# Altium project PCB_PROJECT1.PRJPCB
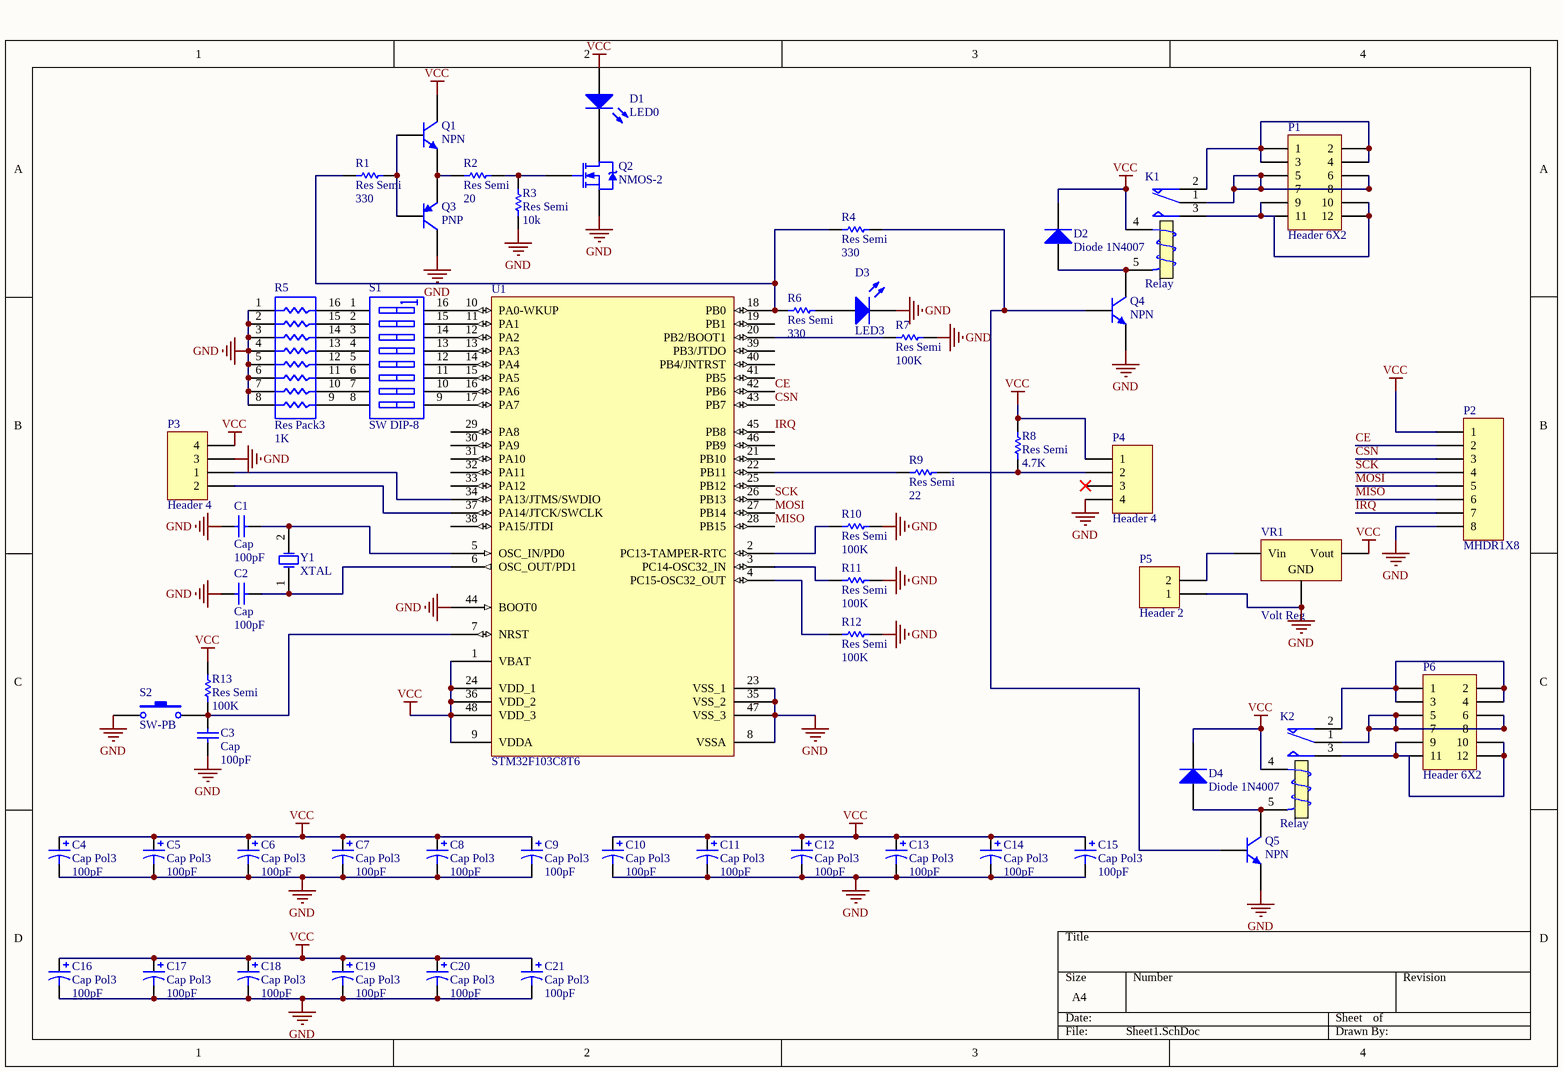
[diagram p0: Sheet1.SchDoc]
1 sheet, 56 parts. Net scope: global (net labels, ports and power ports of the same name join across sheets).
Board file: PCB1.PcbDoc

## Sheet Sheet1.SchDoc
size A4

### Parts
C1  Cap  value 100pF  [0402]
C2  Cap  value 100pF  [0402]
C3  Cap  value 100pF  [0402]
C4  Cap Pol3  value 100pF  [0402]
C5  Cap Pol3  value 100pF  [0402]
C6  Cap Pol3  value 100pF  [0402]
C7  Cap Pol3  value 100pF  [0402]
C8  Cap Pol3  value 100pF  [0402]
C9  Cap Pol3  value 100pF  [0402]
C10  Cap Pol3  value 100pF  [0402]
C11  Cap Pol3  value 100pF  [0402]
C12  Cap Pol3  value 100pF  [0402]
C13  Cap Pol3  value 100pF  [0402]
C14  Cap Pol3  value 100pF  [0402]
C15  Cap Pol3  value 100pF  [0402]
C16  Cap Pol3  value 100pF  [1005[0402]]
C17  Cap Pol3  value 100pF  [1005[0402]]
C18  Cap Pol3  value 100pF  [0402]
C19  Cap Pol3  value 100pF  [0402]
C20  Cap Pol3  value 100pF  [0402]
C21  Cap Pol3  value 100pF  [0402]
D1  LED0  [HA-C1]
D2  Diode 1N4007  [DO-41]
D3  LED3  [3.5X2.8X1.9]
D4  Diode 1N4007  [DO-41]
K1  Relay  [MODULE5B]
K2  Relay  [MODULE5B]
P1  Header 6X2  [HDR2X6]
P2  MHDR1X8  [MHDR1X8]
P3  Header 4  [HDR1X4]
P4  Header 4  [HDR1X4]
P5  Header 2  [HDR1X2]
P6  Header 6X2  [HDR2X6]
Q1  NPN  [TO-226]
Q2  NMOS-2  [TO-220AB]
Q3  PNP  [SOT-23B]
Q4  NPN  [TO-226]
Q5  NPN  [TO-226]
R1  Res Semi  value 330  [2012[0805]]
R2  Res Semi  value 20  [2012[0805]]
R3  Res Semi  value 10k  [2012[0805]]
R4  Res Semi  value 330  [2012[0805]]
R5  Res Pack3  value 1K  [EXB2HV]  (net tie, no BOM)
R6  Res Semi  value 330  [0402]
R7  Res Semi  value 100K  [0402]
R8  Res Semi  value 4.7K  [1005[0402]]
R9  Res Semi  value 22  [0402]
R10  Res Semi  value 100K  [0402]
R11  Res Semi  value 100K  [0402]
R12  Res Semi  value 100K  [0402]
R13  Res Semi  value 100K  [0402]
S1  SW DIP-8  [DIP_SW_8WAY_SMD]
S2  SW-PB  [5025[2010]]
U1  STM32F103C8T6  [LQFP48_L]  (net tie, no BOM)
VR1  Volt Reg  [SOT89]  (net tie, no BOM)
Y1  XTAL  [3225[1210]]

### Nets
GND: C1.1 C2.1 C3.1 C4.2 C5.2 C6.2 C7.2 C8.2 C9.2 C10.2 C11.2 C12.2 C13.2 C14.2 C15.2 C16.2 C17.2 C18.2 C19.2 C20.2 C21.2 D3.2(K) P2.8 P3.3 P4.4 P5.1 Q2.3(S) Q3.1(C) Q4.3(E) Q5.3(E) R3.1 R5.1 R5.2 R5.3 R5.4 R5.5 R5.6 R5.7 R5.8 R7.2 R10.1 R11.1 R12.1 S2.1 U1.8(VSSA) U1.23(VSS_1) U1.35(VSS_2) U1.44(BOOT0) U1.47(VSS_3) VR1.2(GND)
VCC: C4.1 C5.1 C6.1 C7.1 C8.1 C9.1 C10.1 C11.1 C12.1 C13.1 C14.1 C15.1 C16.1 C17.1 C18.1 C19.1 C20.1 C21.1 D1.1(A) D2.2(K) D4.2(K) K1.4(T1) K2.4(T1) P2.1 P3.4 P4.1 Q1.1(C) R8.2 R13.2 U1.1(VBAT) U1.9(VDDA) U1.24(VDD_1) U1.36(VDD_2) U1.48(VDD_3) VR1.3(Vout)
CE: P2.2 U1.42(PB6)
CSN: P2.3 U1.43(PB7)
IRQ: P2.7 U1.45(PB8)
MISO: P2.6 U1.28(PB15)
MOSI: P2.5 U1.27(PB14)
SCK: P2.4 U1.26(PB13)
NetC1_2: C1.2 U1.5(OSC_IN/PD0) Y1.2(OSC2)
NetC2_2: C2.2 U1.6(OSC_OUT/PD1) Y1.1(OSC1)
NetC3_2: C3.2 R13.1 S2.2 U1.7(NRST)
NetD1_2: D1.2(K) Q2.2(D)
NetD2_1: D2.1(A) K1.5(T2) Q4.1(C)
NetD3_1: D3.1(A) R6.2
NetD4_1: D4.1(A) K2.5(T2) Q5.1(C)
NetK1_1: K1.1(COM) P1.5 P1.6 P1.7 P1.8
NetK1_2: K1.2(NC) P1.1 P1.2 P1.3 P1.4
NetK1_3: K1.3(NO) P1.9 P1.10 P1.11 P1.12
NetK2_1: K2.1(COM) P6.5 P6.6 P6.7 P6.8
NetK2_2: K2.2(NC) P6.1 P6.2 P6.3 P6.4
NetK2_3: K2.3(NO) P6.9 P6.10 P6.11 P6.12
NetP3_1: P3.1 U1.34(PA13/JTMS/SWDIO)
NetP3_2: P3.2 U1.37(PA14/JTCK/SWCLK)
NetP4_2: P4.2 R8.1 R9.2
NetP5_2: P5.2 VR1.1(Vin)
NetQ1_2: Q1.2(B) Q3.2(B) R1.2
NetQ1_3: Q1.3(E) Q3.3(E) R2.1
NetQ2_1: Q2.1(G) R2.2 R3.2
NetQ4_2: Q4.2(B) Q5.2(B) R4.2
NetR1_1: R1.1 R4.1 R6.1 U1.18(PB0)
NetR5_9: R5.9 S1.8(A8)
NetR5_10: R5.10 S1.7(A7)
NetR5_11: R5.11 S1.6(A6)
NetR5_12: R5.12 S1.5(A5)
NetR5_13: R5.13 S1.4(A4)
NetR5_14: R5.14 S1.3(A3)
NetR5_15: R5.15 S1.2(A2)
NetR5_16: R5.16 S1.1(A1)
NetR7_1: R7.1 U1.20(PB2/BOOT1)
NetR9_1: R9.1 U1.22(PB11)
NetR10_2: R10.2 U1.2(PC13-TAMPER-RTC)
NetR11_2: R11.2 U1.3(PC14-OSC32_IN)
NetR12_2: R12.2 U1.4(PC15-OSC32_OUT)
NetS1_9: S1.9(B8) U1.17(PA7)
NetS1_10: S1.10(B7) U1.16(PA6)
NetS1_11: S1.11(B6) U1.15(PA5)
NetS1_12: S1.12(B5) U1.14(PA4)
NetS1_13: S1.13(B4) U1.13(PA3)
NetS1_14: S1.14(B3) U1.12(PA2)
NetS1_15: S1.15(B2) U1.11(PA1)
NetS1_16: S1.16(B1) U1.10(PA0-WKUP)

Not connected (* = marked no-connect by the designer): P4 3*; U1 19(PB1) 21(PB10) 25(PB12) 29(PA8) 30(PA9) 31(PA10) 32(PA11) 33(PA12) 38(PA15/JTDI) 39(PB3/JTDO) 40(PB4/JNTRST) 41(PB5) 46(PB9)

### Library data of the parts
C1-C3 = Cap: Capacitor; Published: 8-Jun-2000; LatestRevisionDate: 17-Jul-2002; LatestRevisionNote: Re-released for DXP Platform.; PackageReference: RAD-0.3; Publisher: Altium Limited
C4-C21 = Cap Pol3: Polarized Capacitor (Surface Mount); Published: 8-Jun-2000; LatestRevisionDate: 17-Jul-2002; LatestRevisionNote: Re-released for DXP Platform.; PackageReference: C0805; Publisher: Altium Limited
D1 = LED0: Typical INFRARED GaAs LED; Published: 8-Jun-2000; LatestRevisionDate: 08-Jul-2005; LatestRevisionNote: Mech Layer 1 removed.; PackageReference: LED-0; Publisher: Altium Limited
D2 D4 = Diode 1N4007: 1 Amp General Purpose Rectifier; Published: 8-Jun-2000; LatestRevisionDate: 17-Jul-2002; LatestRevisionNote: Re-released for DXP Platform.; DatasheetDocument: 1998; PackageDocument: Aug-1999; PackageReference: DO-41; Publisher: Altium Limited; Code_JEDEC: DO-204-AL; ComponentLink1Description: Manufacturer Link; ComponentLink1URL: http://www.fairchildsemi.com/; ComponentLink2Description: Datasheet; ComponentLink2URL: http://www.fairchildsemi.com/ds/1N%2F1N4001.pdf
D3 = LED3: Typical BLUE SiC LED; Published: 8-Jun-2000; LatestRevisionDate: 17-Dec-2003; LatestRevisionNote: PCB Footprint replaced.; DatasheetDocument: 16-Apr-2002; PackageDocument: 16-Apr-2002; PackageReference: 3.5X2.8X1.9; Publisher: Altium Limited
K1 K2 = Relay: SPDT Relay; Published: 8-Jun-2000; LatestRevisionDate: 17-Jul-2002; LatestRevisionNote: Re-released for DXP Platform.; PackageReference: MODULE5B; Publisher: Altium Limited
P1 P6 = Header 6X2: Header, 6-Pin, Dual row; LatestRevisionDate: 17-Jul-2002; LatestRevisionNote: Re-released for DXP Platform.; Publisher: Altium Limited
P2 = MHDR1X8: Header, 8-Pin; LatestRevisionDate: 17-Jul-2002; LatestRevisionNote: Re-released for DXP Platform.; Publisher: Altium Limited
P3 P4 = Header 4: Header, 4-Pin; LatestRevisionDate: 17-Jul-2002; LatestRevisionNote: Re-released for DXP Platform.; Publisher: Altium Limited
P5 = Header 2: Header, 2-Pin; LatestRevisionDate: 17-Jul-2002; LatestRevisionNote: Re-released for DXP Platform.; Publisher: Altium Limited
Q1 Q4 Q5 = NPN: NPN Bipolar Transistor; Published: 8-Jun-2000; LatestRevisionDate: 17-Jul-2002; LatestRevisionNote: Re-released for DXP Platform.; PackageReference: TO-226; Publisher: Altium Limited; Code_JEDEC: TO-226-AA
Q2 = NMOS-2: N-Channel Power MOSFET; Note: Pin 2 is electrically connected to pin 4.; Published: 8-Jun-2000; LatestRevisionDate: 17-Jul-2002; LatestRevisionNote: Re-released for DXP Platform.; DatasheetDocument: PD-9.814; PackageReference: TO-220AB; Publisher: Altium Limited; Code_JEDEC: TO-220-AB; ComponentLink1Description: Manufacturer Link; ComponentLink1URL: http://www.irf.com/
Q3 = PNP: PNP Bipolar Transistor; Published: 8-Jun-2000; LatestRevisionDate: 17-Jul-2002; LatestRevisionNote: Re-released for DXP Platform.; PackageReference: SOT-23B; Publisher: Altium Limited; Code_JEDEC: SOT-23
R1-R4 R6-R13 = Res Semi: Semiconductor Resistor; Published: 8-Jun-2000; LatestRevisionDate: 17-Jul-2002; LatestRevisionNote: Re-released for DXP Platform.; PackageReference: AXIAL-0.5; Publisher: Altium Limited
R5 = Res Pack3: Isolated Resistor Network; Published: 24-Mar-1999; LatestRevisionDate: 17-Jul-2002; LatestRevisionNote: Re-released for DXP Platform.; PackageReference: SO-16; Publisher: Altium Limited
S1 = SW DIP-8: DIP Switch, 8 Position, SPST; Published: 24-Mar-1999; LatestRevisionDate: 17-Jul-2002; LatestRevisionNote: Re-released for DXP Platform.; PackageReference: DIP_SW_8WAY_SMD; Publisher: Altium Limited
S2 = SW-PB: Switch; Published: 24-Mar-1999; LatestRevisionDate: 17-Jul-2002; LatestRevisionNote: Re-released for DXP Platform.; PackageReference: SPST-2; Publisher: Altium Limited
U1 = STM32F103C8T6: STM32 ARM-based 32-bit MCU with 64 Kbytes Flash, 48-pin LQFP, Industrial Temperature; Published: *; DatasheetVersion: *; PackageVersion: *; PackageReference: *; Publisher: *; PackageDescription: *; ComponentLink1Description: *; ComponentLink1URL: *; ComponentLink2Description: *; ComponentLink2URL: *
VR1 = Volt Reg: Voltage Regulator; Published: 24-Mar-1999; LatestRevisionDate: 17-Jul-2002; LatestRevisionNote: Re-released for DXP Platform.; PackageReference: D2PAK; Publisher: Altium Limited; Code_JEDEC: SMD-220
Y1 = XTAL: Crystal Oscillator; Published: 8-Jun-2000; LatestRevisionDate: 17-Jul-2002; LatestRevisionNote: Re-released for DXP Platform.; PackageReference: R38; Publisher: Altium Limited